# Altium schematic sheet MCU1.SchDoc
size 420 x 297 mm; Address1: Address1; Address2: Address2; Address3: Address3; Address4: Address4; SheetNumber: 3; SheetTotal: 5; Scale: 1:1; DocumentType: Схема электрическая принципиальная
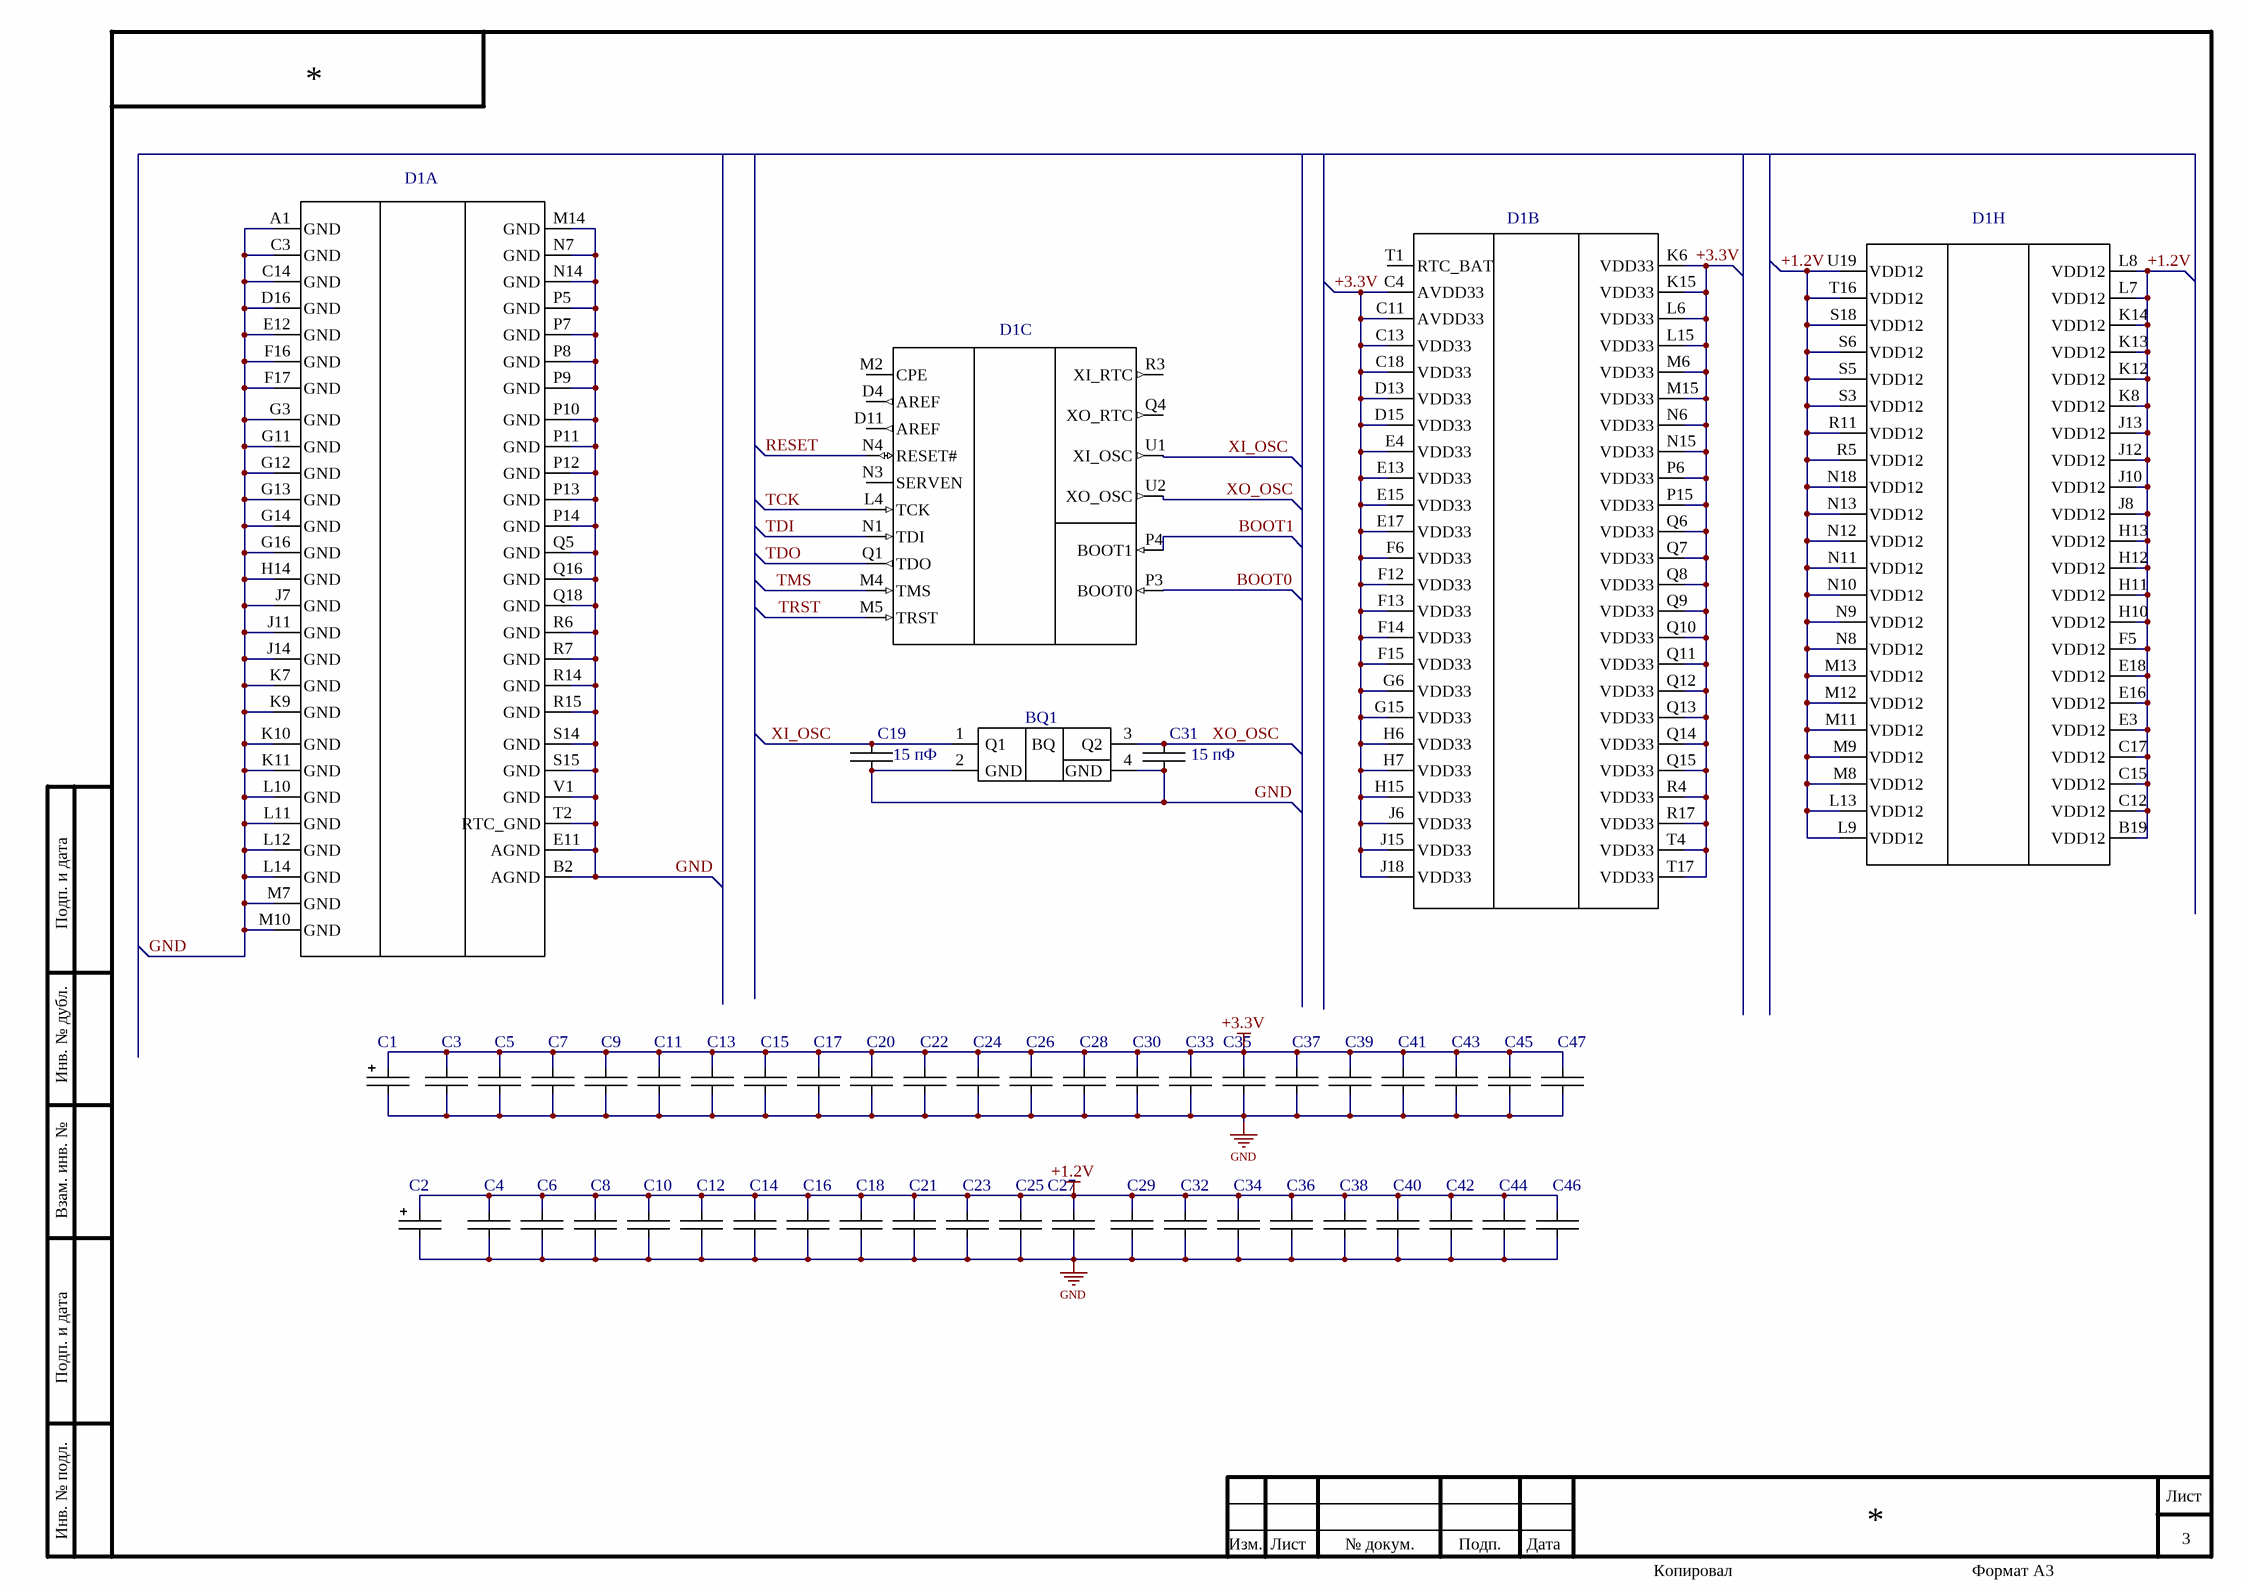
[diagram p0: MCU1.SchDoc]

## Parts
BQ1  Резонатор РК463-5ДС-16,0М  [RK463_BQ_RK-463(Primary)]  (value not drawn)
C1  22 мкФ  [К53-67]  (value not drawn)
C2  22 мкФ  [К53-67]  (value not drawn)
C3  0.1 мкФ  [C0805]  (value not drawn)
C4  0.1 мкФ  [C0805]  (value not drawn)
C5  0.1 мкФ  [C0805]  (value not drawn)
C6  0.1 мкФ  [C0805]  (value not drawn)
C7  0.1 мкФ  [C0805]  (value not drawn)
C8  0.1 мкФ  [C0805]  (value not drawn)
C9  0.1 мкФ  [C0805]  (value not drawn)
C10  0.1 мкФ  [C0805]  (value not drawn)
C11  0.1 мкФ  [C0805]  (value not drawn)
C12  0.1 мкФ  [C0805]  (value not drawn)
C13  0.1 мкФ  [C0805]  (value not drawn)
C14  0.1 мкФ  [C0805]  (value not drawn)
C15  0.1 мкФ  [C0805]  (value not drawn)
C16  0.1 мкФ  [C0805]  (value not drawn)
C17  0.1 мкФ  [C0805]  (value not drawn)
C18  0.1 мкФ  [C0805]  (value not drawn)
C19  15 пФ  [C0805]
C20  0.1 мкФ  [C0805]  (value not drawn)
C21  0.1 мкФ  [C0805]  (value not drawn)
C22  0.1 мкФ  [C0805]  (value not drawn)
C23  0.1 мкФ  [C0805]  (value not drawn)
C24  0.1 мкФ  [C0805]  (value not drawn)
C25  0.1 мкФ  [C0805]  (value not drawn)
C26  0.1 мкФ  [C0805]  (value not drawn)
C27  0.1 мкФ  [C0805]  (value not drawn)
C28  0.1 мкФ  [C0805]  (value not drawn)
C29  0.1 мкФ  [C0805]  (value not drawn)
C30  0.1 мкФ  [C0805]  (value not drawn)
C31  15 пФ  [C0805]
C32  0.1 мкФ  [C0805]  (value not drawn)
C33  0.1 мкФ  [C0805]  (value not drawn)
C34  0.1 мкФ  [C0805]  (value not drawn)
C35  0.1 мкФ  [C0805]  (value not drawn)
C36  0.1 мкФ  [C0805]  (value not drawn)
C37  0.1 мкФ  [C0805]  (value not drawn)
C38  0.1 мкФ  [C0805]  (value not drawn)
C39  0.1 мкФ  [C0805]  (value not drawn)
C40  0.1 мкФ  [C0805]  (value not drawn)
C41  0.1 мкФ  [C0805]  (value not drawn)
C42  0.1 мкФ  [C0805]  (value not drawn)
C43  0.1 мкФ  [C0805]  (value not drawn)
C44  0.1 мкФ  [C0805]  (value not drawn)
C45  0.1 мкФ  [C0805]  (value not drawn)
C46  0.1 мкФ  [C0805]  (value not drawn)
C47  0.1 мкФ  [C0805]  (value not drawn)
D1  1921ВК028  [BGA-400_21.0X21.0MM_LAYOUT20X20_P1.0MM]  (value not drawn)  (parts A,B,C,H of 8)

## Nets
+1.2V: C2.1 C4.1 C6.1 C8.1 C10.1 C12.1 C14.1 C16.1 C18.1 C21.1 C23.1 C25.1 C27.1 C29.1 C32.1 C34.1 C36.1 C38.1 C40.1 C42.1 C44.1 C46.1 D1.B19(VDD12) D1.C12(VDD12) D1.C15(VDD12) D1.C17(VDD12) D1.E3(VDD12) D1.E16(VDD12) D1.E18(VDD12) D1.F5(VDD12) D1.H10(VDD12) D1.H11(VDD12) D1.H12(VDD12) D1.H13(VDD12) D1.J8(VDD12) D1.J10(VDD12) D1.J12(VDD12) D1.J13(VDD12) D1.K8(VDD12) D1.K12(VDD12) D1.K13(VDD12) D1.K14(VDD12) D1.L7(VDD12) D1.L8(VDD12) D1.L9(VDD12) D1.L13(VDD12) D1.M8(VDD12) D1.M9(VDD12) D1.M11(VDD12) D1.M12(VDD12) D1.M13(VDD12) D1.N8(VDD12) D1.N9(VDD12) D1.N10(VDD12) D1.N11(VDD12) D1.N12(VDD12) D1.N13(VDD12) D1.N18(VDD12) D1.R5(VDD12) D1.R11(VDD12) D1.S3(VDD12) D1.S5(VDD12) D1.S6(VDD12) D1.S18(VDD12) D1.T16(VDD12) D1.U19(VDD12)
+3.3V: C1.1 C3.1 C5.1 C7.1 C9.1 C11.1 C13.1 C15.1 C17.1 C20.1 C22.1 C24.1 C26.1 C28.1 C30.1 C33.1 C35.1 C37.1 C39.1 C41.1 C43.1 C45.1 C47.1 D1.C4(AVDD33) D1.C11(AVDD33) D1.C13(VDD33) D1.C18(VDD33) D1.D13(VDD33) D1.D15(VDD33) D1.E4(VDD33) D1.E13(VDD33) D1.E15(VDD33) D1.E17(VDD33) D1.F6(VDD33) D1.F12(VDD33) D1.F13(VDD33) D1.F14(VDD33) D1.F15(VDD33) D1.G6(VDD33) D1.G15(VDD33) D1.H6(VDD33) D1.H7(VDD33) D1.H15(VDD33) D1.J6(VDD33) D1.J15(VDD33) D1.J18(VDD33) D1.K6(VDD33) D1.K15(VDD33) D1.L6(VDD33) D1.L15(VDD33) D1.M6(VDD33) D1.M15(VDD33) D1.N6(VDD33) D1.N15(VDD33) D1.P6(VDD33) D1.P15(VDD33) D1.Q6(VDD33) D1.Q7(VDD33) D1.Q8(VDD33) D1.Q9(VDD33) D1.Q10(VDD33) D1.Q11(VDD33) D1.Q12(VDD33) D1.Q13(VDD33) D1.Q14(VDD33) D1.Q15(VDD33) D1.R4(VDD33) D1.R17(VDD33) D1.T4(VDD33) D1.T17(VDD33)
GND: BQ1.2(GND) BQ1.4(GND) C1.2 C2.2 C3.2 C4.2 C5.2 C6.2 C7.2 C8.2 C9.2 C10.2 C11.2 C12.2 C13.2 C14.2 C15.2 C16.2 C17.2 C18.2 C19.2 C20.2 C21.2 C22.2 C23.2 C24.2 C25.2 C26.2 C27.2 C28.2 C29.2 C30.2 C31.2 C32.2 C33.2 C34.2 C35.2 C36.2 C37.2 C38.2 C39.2 C40.2 C41.2 C42.2 C43.2 C44.2 C45.2 C46.2 C47.2 D1.A1(GND) D1.B2(AGND) D1.C3(GND) D1.C14(GND) D1.D16(GND) D1.E11(AGND) D1.E12(GND) D1.F16(GND) D1.F17(GND) D1.G3(GND) D1.G11(GND) D1.G12(GND) D1.G13(GND) D1.G14(GND) D1.G16(GND) D1.H14(GND) D1.J7(GND) D1.J11(GND) D1.J14(GND) D1.K7(GND) D1.K9(GND) D1.K10(GND) D1.K11(GND) D1.L10(GND) D1.L11(GND) D1.L12(GND) D1.L14(GND) D1.M7(GND) D1.M10(GND) D1.M14(GND) D1.N7(GND) D1.N14(GND) D1.P5(GND) D1.P7(GND) D1.P8(GND) D1.P9(GND) D1.P10(GND) D1.P11(GND) D1.P12(GND) D1.P13(GND) D1.P14(GND) D1.Q5(GND) D1.Q16(GND) D1.Q18(GND) D1.R6(GND) D1.R7(GND) D1.R14(GND) D1.R15(GND) D1.S14(GND) D1.S15(GND) D1.T2(RTC_GND) D1.V1(GND)
BOOT0: D1.P3(BOOT0)
BOOT1: D1.P4(BOOT1)
RESET: D1.N4(RESET#)
TCK: D1.L4(TCK)
TDI: D1.N1(TDI)
TDO: D1.Q1(TDO)
TMS: D1.M4(TMS)
TRST: D1.M5(TRST)
XI_OSC: BQ1.1(Q1) C19.1 D1.U1(XI_OSC)
XO_OSC: BQ1.3(Q2) C31.1 D1.U2(XO_OSC)

Not connected (* = marked no-connect by the designer): D1 D4(AREF) D11(AREF) M2(CPE) N3(SERVEN) Q4(XO_RTC) R3(XI_RTC) T1(RTC_BAT)

## Notes on the sheet
- Подп. и дата
- Инв. № дубл.
- Взам. инв. №
- Инв. № подл.
- Изм.
- Лист
- № докум.
- Подп.
- Дата
- Копировал
- Формат А3

## Library data of the parts
BQ1 = РК463-5ДС: Кварцевый резонатор; TU: ТУ6321-011-07604008-07; TUHolder: "Пьезотрон"; TypePrefix: BQ; PartNumber: Резонатор РК463-5ДС-16,0М
C1 C2 = К53-67: Оксидно-полупроводниковый танталовый чип-конденсатор серии К53-68; PartNumber: К53-67 "*"-* В-* мкФ ±*%; TypePrefix: C; TU: АЖЯР.673546.006 ТУ; TUHolder: ОАО НИИ "ГИРИКОНД"; Value: *; PackegeType: *
C3-C18 C20-C30 C32-C47 = К10-69_0.1mk: Керамический чип-конденсатор серии К10-69; PartNumber: К10-69в-*-* В- * ± *% *; TypePrefix: C; TU: АЖЯР.673511.002ТУ; TUHolder: ОАО НИИ "ГИРИКОНД"; Value: *; PackegeType: *
C19 C31 = К10-69в_15p: Конденсатор неполярный
D1 = 1921ВК028: МК 1921ВК028; TypePrefix: Микроконтроллер; TU: АЕНВ.431290.444ТУ; TUHolder: АО «НИИЭТ», Россия, г.Воронеж; Prefix: D; TypeName: Микросхемы интегральные; Value: *; PartNumber: 1921ВК028